# EAGLE design 1591XXM-RS485 to Neopixel with RJ45 (EAGLE 9.4.2)
RS485 over Ethernet to NeoPixel for Hammond 1591XXA enclosures
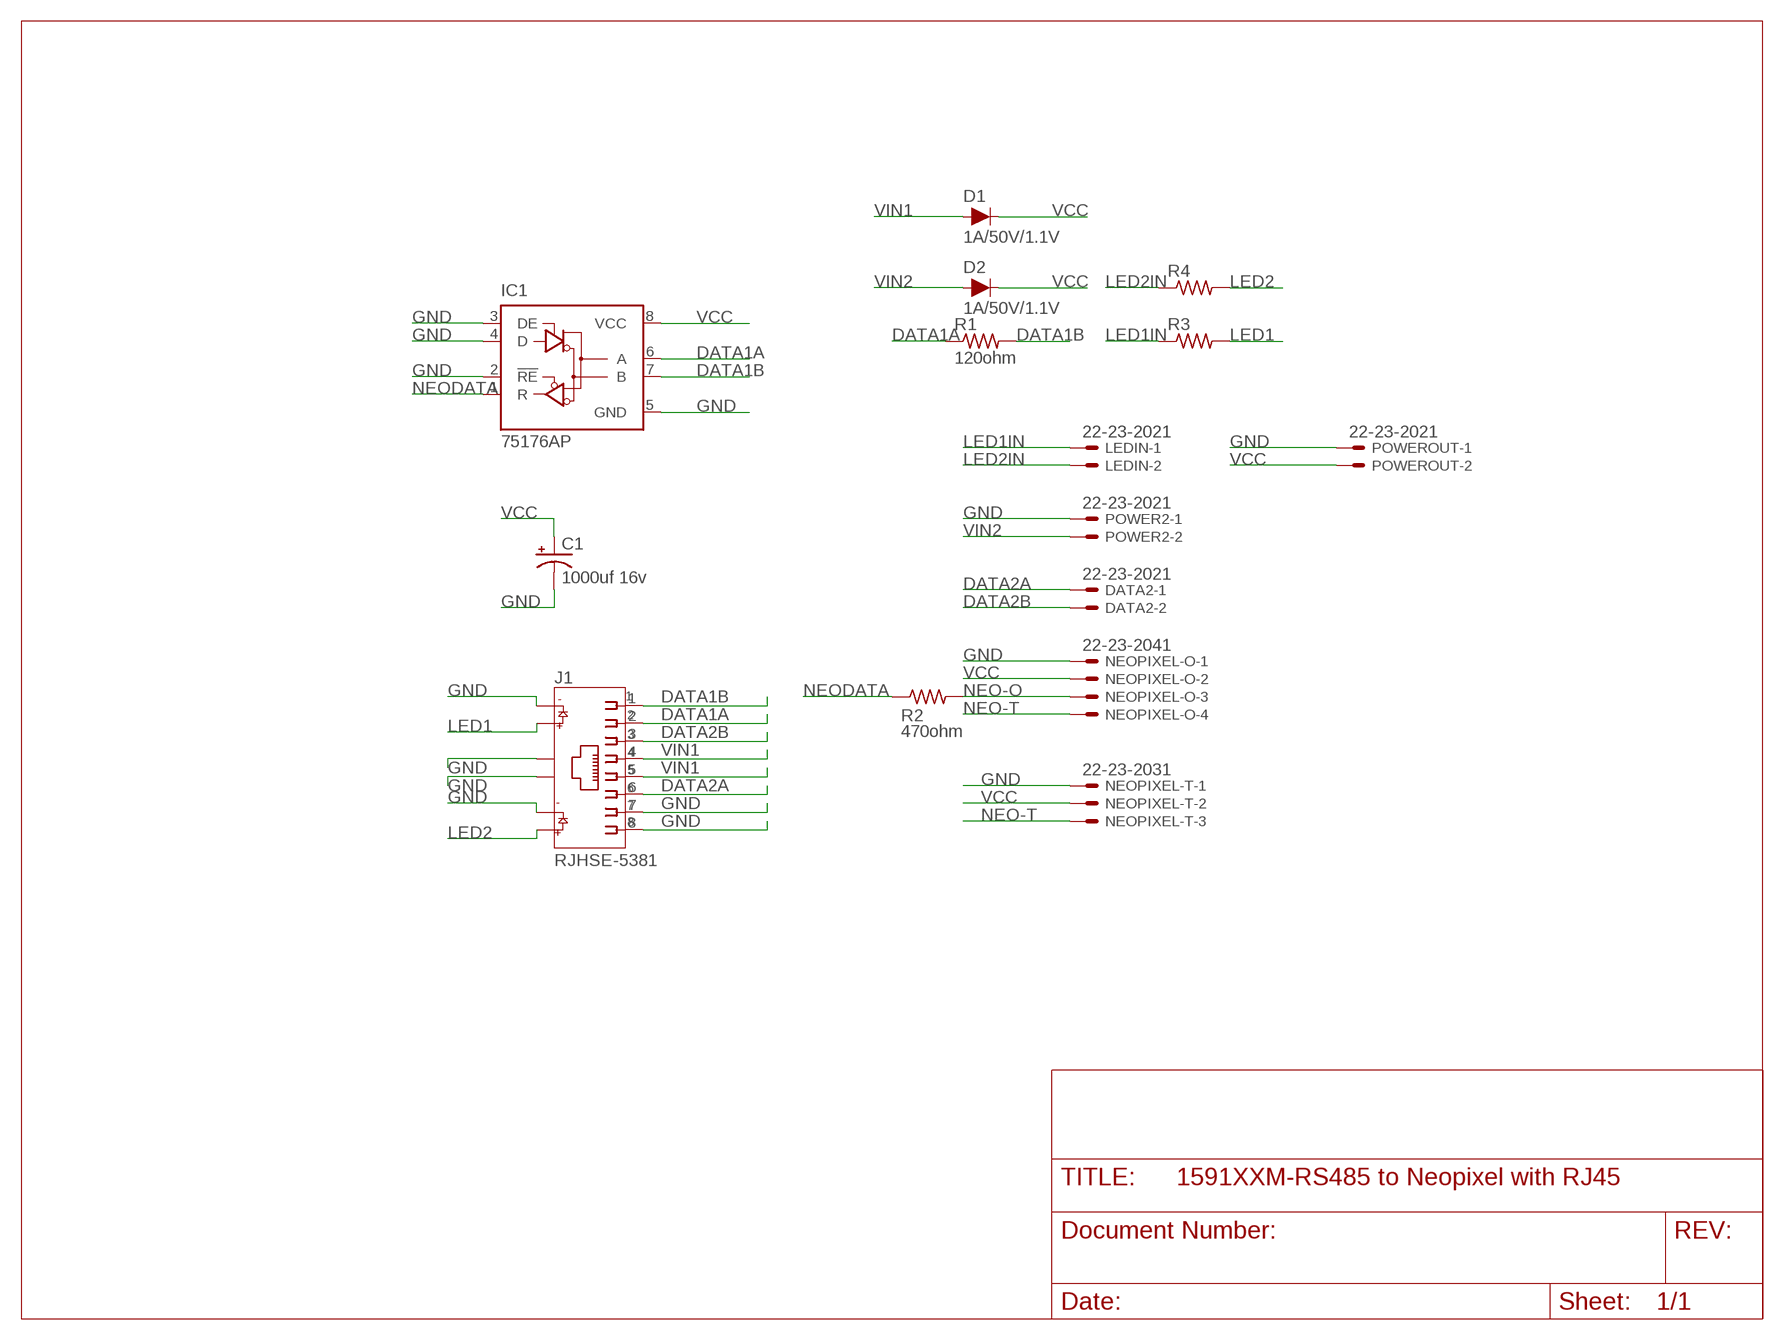
[diagram p0: schematic, sheet 1]

## Parts
C1  1000uf 16v  1000UF-RADIAL-5MM-25V-20%  [CPOL-RADIAL-5MM-10MM]
D1  1A/50V/1.1V  DIODE-PTH  [DIODE-1N4001]
D2  1A/50V/1.1V  DIODE-PTH  [DIODE-1N4001]
DATA2  22-23-2021  [22-23-2021]
IC1  75176AP  [DIL08]
J1  RJHSE-5381  [AMPHENOL_RJHSE-5381]
LEDIN  22-23-2021  [22-23-2021]
NEOPIXEL-O  22-23-2041  [22-23-2041]
NEOPIXEL-T  22-23-2031  [22-23-2031]
POWER2  22-23-2021  [22-23-2021]
POWEROUT  22-23-2021  [22-23-2021]
R1  120ohm  R-US_0207/10  [0207/10]
R2  470ohm  R-US_0207/10  [0207/10]
R3  R-US_0207/10  [0207/10]
R4  R-US_0207/10  [0207/10]

## Nets
DATA1A: IC1.6(A) J1.2 R1.1
DATA1B: IC1.7(B) J1.1 R1.2
DATA2A: DATA2.1 J1.6
DATA2B: DATA2.2 J1.3
GND: C1.- IC1.2(!RE) IC1.3(DE) IC1.4(D) IC1.5(GND) J1.7 J1.8 J1.9 J1.11 J1.S1 J1.S2 NEOPIXEL-O.1 NEOPIXEL-T.1 POWER2.1 POWEROUT.1
LED1: J1.10 R3.2
LED1IN: LEDIN.1 R3.1
LED2: J1.12 R4.2
LED2IN: LEDIN.2 R4.1
NEO-O: NEOPIXEL-O.3 R2.2
NEO-T: NEOPIXEL-O.4 NEOPIXEL-T.3
NEODATA: IC1.1(R) R2.1
VCC: C1.+ D1.C D2.C IC1.8(VCC) NEOPIXEL-O.2 NEOPIXEL-T.2 POWEROUT.2
VIN1: D1.A J1.4 J1.5
VIN2: D2.A POWER2.2

## Library data of the parts
C1 = SparkFun-Capacitors:1000UF: 1,000µF/1mF ceramic capacitors A capacitor is a passive two-terminal electrical component used to store electrical energy temporarily in an electric field. CAP-08070; PROD_ID: CAP-09538; VALUE: 1mF
D1 D2 = SparkFun-DiscreteSemi:DIODE: Diode These are standard reverse protection diodes and small signal diodes. SparkFun Products: SparkFun SparkPunk Sound Kit <https://www.sparkfun.com/products/11177> SparkFun ESP8266 Thing <https://www.sparkfun.com/products/13231>; PROD_ID: DIO-09176
DATA2 LEDIN POWER2 POWEROUT = con-molex:22-23-2021: .100" (2.54mm) Center Header - 2 Pin; MF: MOLEX; MPN: 22-23-2021; OC_FARNELL: 1462926; OC_NEWARK: 25C3832
IC1 = 751xx:75176A: DIFFERENTIAL BUS TRANSCEIVER Source: http://focus.ti.com/lit/ds/symlink/sn75176a.pdf
J1 = RJHSE-5381:RJHSE-5381: connector, mod jack, rt angle pcb, shielded, led1-g, led2-y, single port, rj-45 8 cont; AVAILABILITY: Unavailable; DESCRIPTION: connector, mod jack, rt angle pcb, shielded, led1-g, led2-y, single port, rj-45 8 cont; MF: Amphenol ICC; MP: RJHSE-5381; PACKAGE: None; PRICE: None
NEOPIXEL-O = con-molex:22-23-2041: .100" (2.54mm) Center Header - 4 Pin; MF: MOLEX; MPN: 22-23-2041; OC_FARNELL: 1462920; OC_NEWARK: 38C0355
NEOPIXEL-T = con-molex:22-23-2031: .100" (2.54mm) Center Header - 3 Pin; MF: MOLEX; MPN: 22-23-2031; OC_FARNELL: 1462950; OC_NEWARK: 30C0862
R1-R4 = rcl:R-US_: RESISTOR, American symbol; SPICEPREFIX: R

## Board
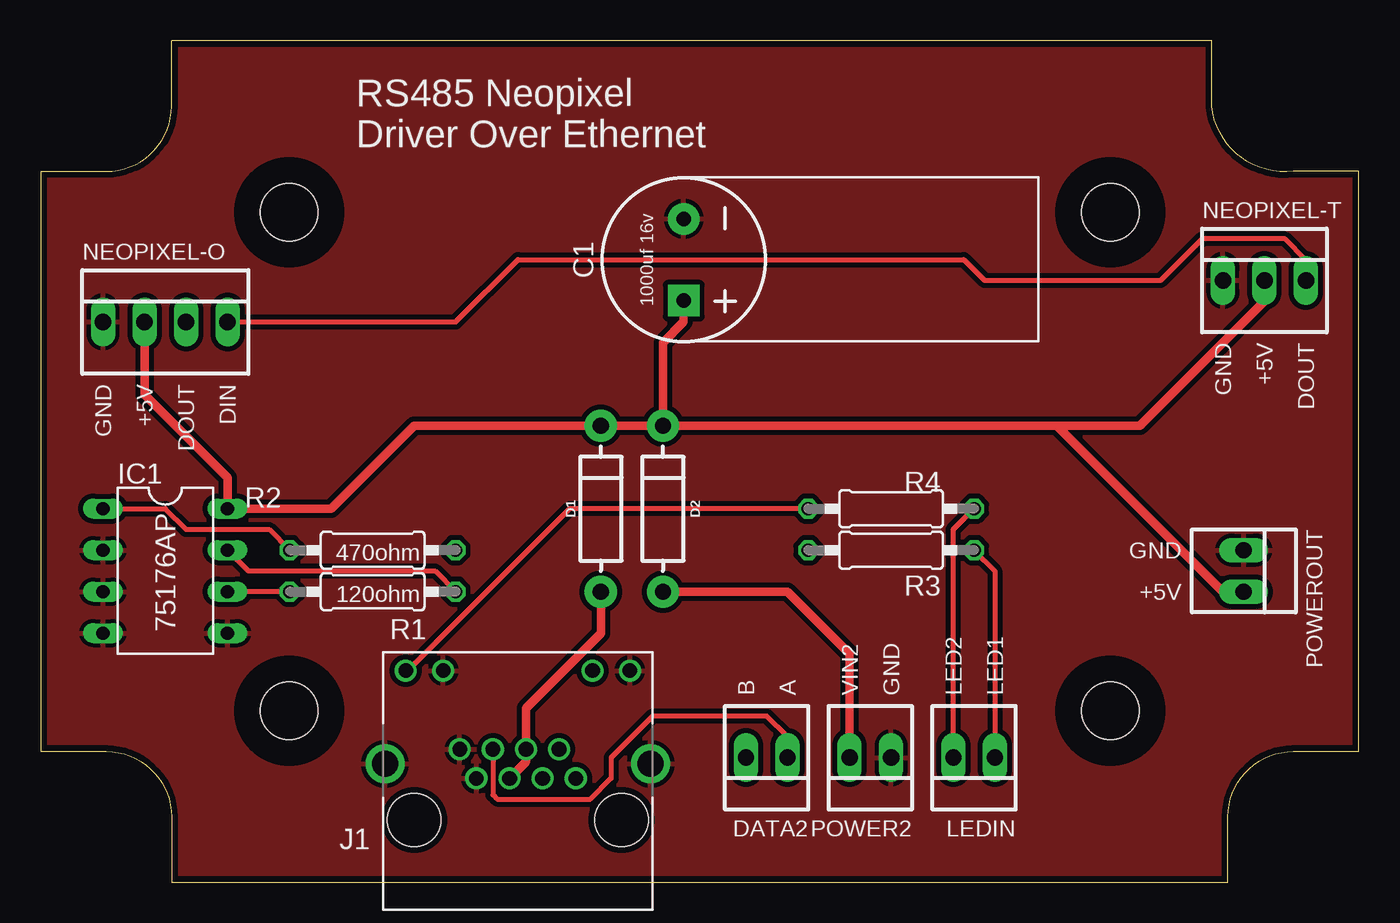
[diagram p1: board, top side]
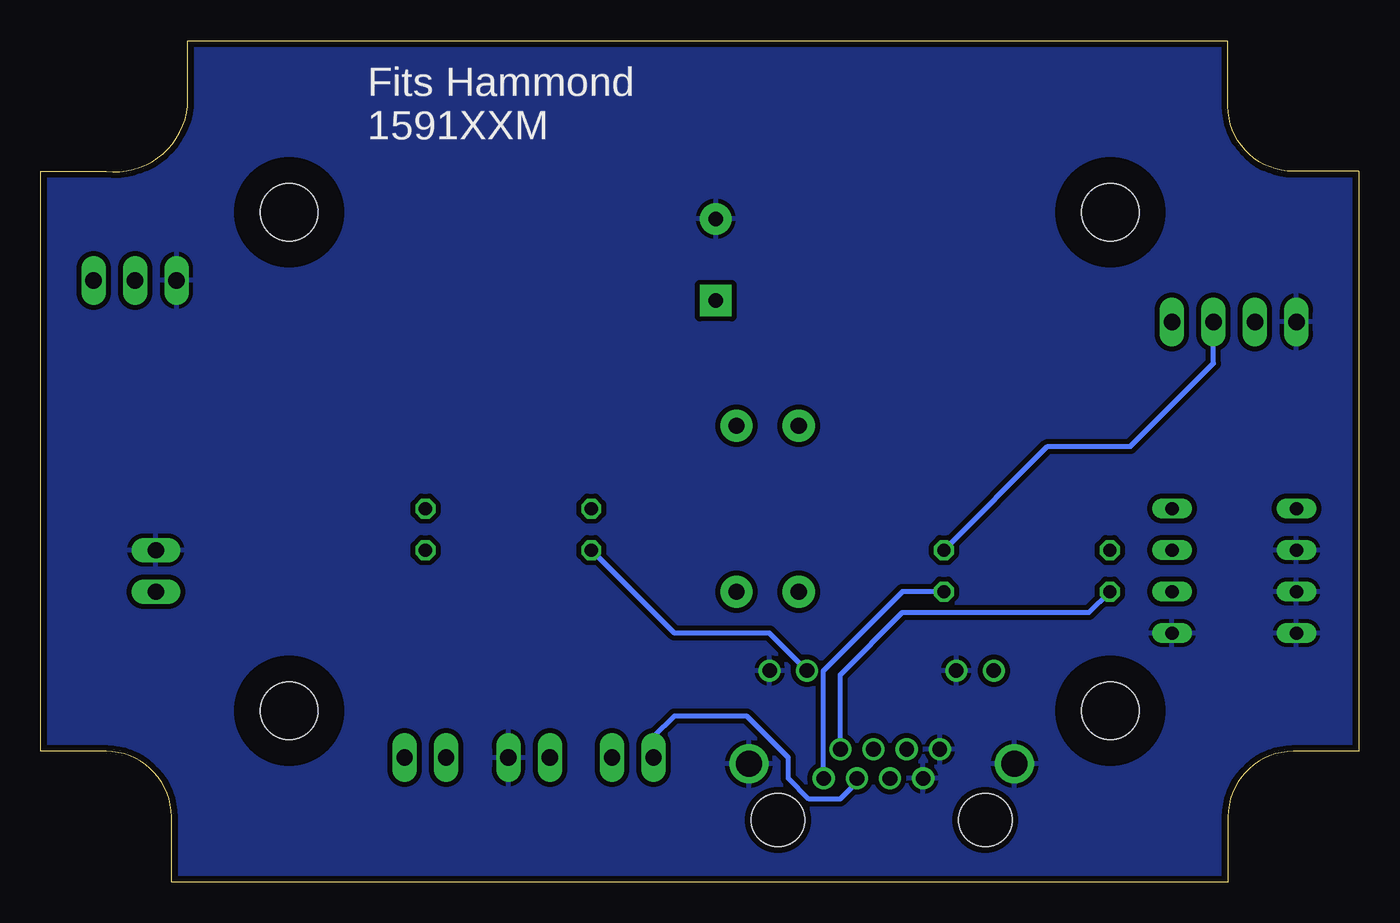
[diagram p2: board, bottom side, seen from below]

Size 80.7 x 51.5 mm. Coordinates in mm from the lower left corner, seen from the top.
Copper layers (1*16): Top 0.035559375mm / dielectric 1.6mm / Bottom 0.035559375mm
Design rules "oshpark-2layer": minimum track width 6mil, minimum drill 10mil, track to track 6mil, track to pad 6mil, pad to pad 6mil, via to via 6mil, smd to smd 6mil, copper to edge 15mil, drill to drill 6mil, minimum pad ring 5mil, minimum via ring 5mil, stop-mask expansion 2.5mil, vias tented up to drill 0mil, thermal gap 10mil

### Footprints (pad centres in the part's own frame; a part is rotated, then mirrored left to right if it is on the bottom)
CPOL-RADIAL-5MM-10MM = drill 0.9 pad 1.93 square: + 2.5,0 | drill 0.9 pad 1.93: - -2.5,0
DIODE-1N4001 = drill 1 pad 1.981: A -5.08,0; C 5.08,0
22-23-2021 = drill 1 long: 1 -1.27,0; 2 1.27,0
DIL08 = drill 0.813 long: 1 -3.81,-3.81; 2 -1.27,-3.81; 3 1.27,-3.81; 4 3.81,-3.81; 5 3.81,3.81; 6 1.27,3.81; 7 -1.27,3.81; 8 -3.81,3.81
AMPHENOL_RJHSE-5381 = drill 0.9: 1 3.55,2.54; 2 2.53,4.32; 3 1.52,2.54; 4 0.5,4.32; 5 -0.51,2.54; 6 -1.53,4.32; 7 -2.54,2.54; 8 -3.56,4.32; 9 6.86,9.14; 10 4.57,9.14; 11 -4.57,9.14; 12 -6.86,9.14 | drill 1.6: S1 8.13,3.43; S2 -8.13,3.43 | hole 3.25: 6.35,0; -6.35,0
22-23-2041 = drill 1 long: 1 -3.81,0; 2 -1.27,0; 3 1.27,0; 4 3.81,0
22-23-2031 = drill 1 long: 1 -2.54,0; 2 0,0; 3 2.54,0
0207/10 = drill 0.813 octagon: 1 -5.08,0; 2 5.08,0
1591XXM = hole 3.5: 65.485,10.5; 15.215,41.01; 65.485,41.01; 15.215,10.5

### Placement (x,y rotation side)
C1  39.37,38.1 270 top
D1  34.29,22.86 90 top
D2  38.1,22.86 90 top
DATA2  44.45,7.62 180 top
IC1  7.62,19.05 270 top
J1  29.21,3.81 0 top
LEDIN  57.15,7.62 180 top
NEOPIXEL-O  7.62,34.29 0 top
NEOPIXEL-T  74.93,36.83 0 top
POWER2  50.8,7.62 180 top
POWEROUT  73.66,19.05 270 top
R1  20.32,17.78 0 top
R2  20.32,20.32 0 top
R3  52.07,20.32 180 top
R4  52.07,22.86 180 top
U$1  [1591XXM]  0,0 0 top

### Tracks (layer width: path | path; a pad name or v marks a point on that pad's centre or on a via)
DATA1A
  Top 0.305: R1.1 IC1.6
  Bottom 0.305: J1.2 31.74,12.71 27.94,16.51 16.51,16.51 R1.1
DATA1B
  Top 0.305: IC1.7 12.7,19.05 24.13,19.05 R1.2
  Bottom 0.305: R1.2 27.94,17.78 32.8,12.92 32.8,6.39 J1.1
DATA2A
  Top 0.305: J1.6 27.68,5.34 27.94,5.08 33.66,5.08 34.92,6.35 34.92,7.62 37.47,10.16 44.45,10.16 45.72,8.89 DATA2.1
DATA2B
  Bottom 0.305: J1.3 30.73,6.1 31.75,5.08 33.66,5.08 34.92,6.35 34.92,7.62 37.47,10.16 41.91,10.16 43.18,8.89 DATA2.2
GND
  pour Top (isolate 0.305): 0,0 0,52.07 81.28,52.07 81.28,0
  pour Bottom (isolate 0.305): 0,0 0,52.07 81.28,52.07 81.28,7.62 83.82,5.08 83.82,0
LED1
  Bottom 0.305: J1.10 36.07,15.24 41.91,15.24 R3.2
LED1IN
  Top 0.305: R3.1 58.42,19.05 LEDIN.1
LED2
  Top 0.305: J1.12 22.48,12.95 32.38,22.86 R4.2
LED2IN
  Top 0.305: LEDIN.2 55.88,21.59 R4.1
NEO-O
  Bottom 0.305: R2.2 19.05,26.67 13.97,26.67 8.89,31.75 NEOPIXEL-O.3
NEO-T
  Top 0.305: NEOPIXEL-O.4 25.4,34.29 29.21,38.1 56.52,38.1 57.78,36.83 68.58,36.83 71.12,39.37 76.2,39.37 77.47,38.1 NEOPIXEL-T.3
NEODATA
  Top 0.305: IC1.1 7.62,22.86 8.89,21.59 13.97,21.59 R2.1
VCC
  Top 0.508: D2.C D1.C 22.86,27.94 17.78,22.86 IC1.8 11.43,24.77 6.35,29.84 NEOPIXEL-O.2 | D2.C 38.1,33.02 39.37,34.29 C1.+ | D2.C 62.23,27.94 | POWEROUT.2 72.39,17.78 62.23,27.94 | NEOPIXEL-T.2 74.93,35.56 67.31,27.94 62.23,27.94
VIN1
  Top 0.508: J1.5 29.71,7.36 J1.4 29.71,10.66 34.29,15.24 D1.A
VIN2
  Top 0.508: POWER2.2 49.53,13.97 45.72,17.78 D2.A

### Text on the board
tNames: RS485 Neopixel / Driver Over Ethernet | GND | +5V | DOUT | GND | +5V | DOUT | DIN | GND | +5V | B | A | VIN2 | GND | LED2 | LED1
bNames: Fits Hammond / 1591XXM